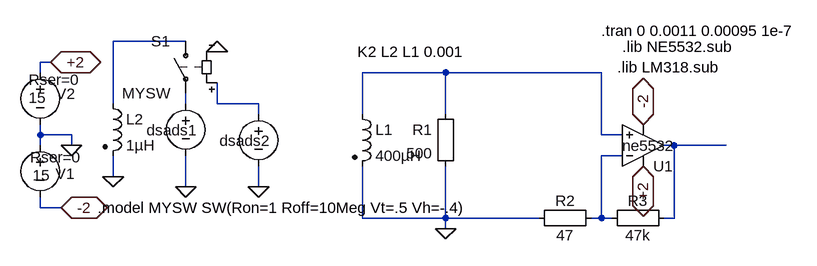
[diagram p0: schematic nehative_capcaitance_BS_3_ideal_small_gold_nugget.asc]
nehative_capcaitance_BS_3_ideal_small_gold_nugget.asc, the LTspice schematic file:
Version 4
SHEET 1 880 680
WIRE -736 -48 -848 -48
WIRE -944 -16 -960 -16
WIRE -960 0 -960 -16
WIRE -336 0 -464 0
WIRE -96 0 -336 0
WIRE -848 48 -848 -48
WIRE -736 48 -736 32
WIRE -688 48 -688 16
WIRE -624 48 -688 48
WIRE -624 64 -624 48
WIRE -464 64 -464 0
WIRE -336 64 -336 0
WIRE -960 96 -960 80
WIRE -912 96 -960 96
WIRE -96 96 -96 0
WIRE -64 96 -96 96
WIRE -960 112 -960 96
WIRE -912 112 -912 96
WIRE 16 112 0 112
WIRE 96 112 16 112
WIRE -64 128 -96 128
WIRE -848 160 -848 128
WIRE -736 176 -736 128
WIRE -624 176 -624 144
WIRE -960 208 -960 192
WIRE -928 208 -960 208
WIRE -464 224 -464 144
WIRE -336 224 -336 144
WIRE -336 224 -464 224
WIRE -192 224 -336 224
WIRE -96 224 -96 128
WIRE -96 224 -112 224
WIRE -80 224 -96 224
WIRE 16 224 16 112
WIRE 16 224 0 224
WIRE -336 240 -336 224
FLAG -32 144 +2
IOPIN -32 144 BiDir
FLAG -32 80 -2
IOPIN -32 80 BiDir
FLAG -336 240 0
FLAG -736 176 0
FLAG -928 208 -2
IOPIN -928 208 BiDir
FLAG -944 -16 +2
IOPIN -944 -16 BiDir
FLAG -912 112 0
FLAG -624 176 0
FLAG -848 160 0
FLAG -688 -32 0
SYMBOL Opamps\\opamp2 -32 176 M180
WINDOW 3 -32 63 Left 2
SYMATTR Value ne5532
SYMATTR InstName U1
SYMBOL Misc\\EuropeanResistor -208 240 R270
WINDOW 0 27 56 VTop 2
WINDOW 3 5 56 VBottom 2
SYMATTR InstName R2
SYMATTR Value 47
SYMBOL Misc\\EuropeanResistor -96 240 R270
WINDOW 0 27 56 VTop 2
WINDOW 3 5 56 VBottom 2
SYMATTR InstName R3
SYMATTR Value 47k
SYMBOL ind2 -480 48 R0
SYMATTR InstName L1
SYMATTR Value 400µH
SYMATTR SpiceLine Rser=.4 Cpar=220p
SYMATTR Type ind
SYMBOL ind2 -864 32 R0
SYMATTR InstName L2
SYMATTR Value 1µH
SYMATTR SpiceLine Rser=.1 Rpar=1 Cpar=1p
SYMATTR Type ind
SYMBOL voltage -736 32 M0
WINDOW 0 -18 57 Left 2
WINDOW 3 -134 119 Invisible 2
WINDOW 123 0 0 Left 2
SYMATTR InstName dsads1
SYMATTR Value .01
SYMATTR SpiceLine Rser=0
SYMBOL voltage -960 96 M0
WINDOW 123 0 0 Left 2
WINDOW 39 -63 34 Left 2
WINDOW 0 -53 60 Left 2
WINDOW 3 -15 62 Left 2
SYMATTR SpiceLine Rser=0
SYMATTR InstName V1
SYMATTR Value 15
SYMBOL voltage -960 -16 M0
WINDOW 123 0 0 Left 2
WINDOW 39 -61 27 Left 2
WINDOW 0 -54 49 Left 2
WINDOW 3 -9 55 Left 2
SYMATTR SpiceLine Rser=0
SYMATTR InstName V2
SYMATTR Value 15
SYMBOL sw -736 -64 M0
SYMATTR InstName S1
SYMATTR Value MYSW
SYMBOL voltage -624 48 M0
WINDOW 0 -18 57 Left 2
WINDOW 3 -134 119 Invisible 2
WINDOW 123 0 0 Left 2
SYMATTR InstName dsads2
SYMATTR Value PULSE(0 10 0 1e-10 1e-10 .000001 .001 1000)
SYMBOL Misc\\EuropeanResistor -320 48 M0
SYMATTR InstName R1
SYMATTR Value 500
TEXT -472 -32 Left 2 !K2 L2 L1 0.001
TEXT -96 -64 Left 2 !.tran 0 0.0011 0.00095 1e-7
TEXT -64 -40 Left 2 !.lib NE5532.sub
TEXT -72 -8 Left 2 !.lib LM318.sub
TEXT -872 208 Left 2 !.model MYSW SW(Ron=1 Roff=10Meg Vt=.5 Vh=-.4)

The netlist it stands for:
* nehative_capcaitance_BS_3_ideal_small_gold_nugget.asc
XU1 N002 N006 +2 -2 N005 ne5532  ; pins In+ In- V+ V- OUT
R2 0 N006 47
R3 N006 N005 47k
L1 N002 0 400µH Rser=.4 Cpar=220p
L2 N001 0 1µH Rser=.1 Rpar=1 Cpar=1p
V§dsads1 N003 0 .01 Rser=0
V1 0 -2 15 Rser=0
V2 +2 0 15 Rser=0
S1 N001 N003 N004 0 MYSW
V§dsads2 N004 0 PULSE(0 10 0 1e-10 1e-10 .000001 .001 1000)
R1 N002 0 500
K2 L2 L1 0.001
.tran 0 0.0011 0.00095 1e-7
.lib NE5532.sub
.lib LM318.sub
.model MYSW SW(Ron=1 Roff=10Meg Vt=.5 Vh=-.4)
.backanno
.end